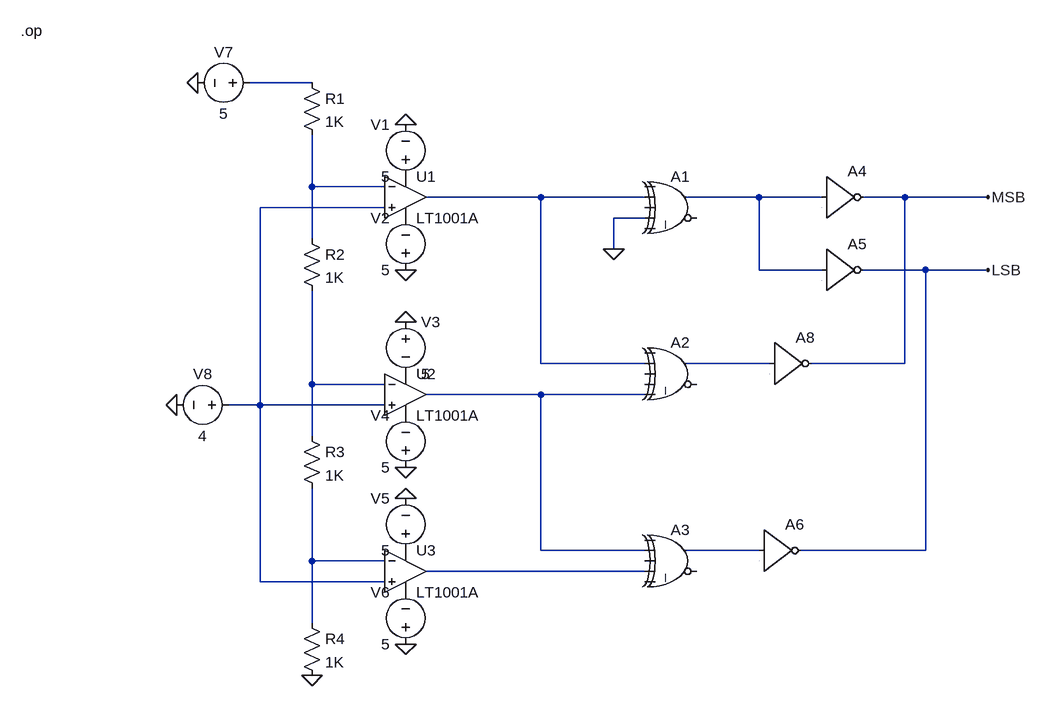
[diagram p0: schematic ADC using Op Amps.asc]
ADC using Op Amps.asc, the LTspice schematic file:
Version 4
SHEET 1 1192 708
WIRE 48 -224 -48 -224
WIRE 48 -64 48 -144
WIRE 160 -64 48 -64
WIRE 400 -48 224 -48
WIRE 560 -48 400 -48
WIRE 736 -48 624 -48
WIRE 832 -48 736 -48
WIRE 960 -48 896 -48
WIRE 1088 -48 960 -48
WIRE 160 -32 -32 -32
WIRE 560 -16 512 -16
WIRE 48 16 48 -64
WIRE 512 32 512 -16
WIRE 736 64 736 -48
WIRE 832 64 736 64
WIRE 992 64 896 64
WIRE 1088 64 992 64
WIRE 400 208 400 -48
WIRE 560 208 400 208
WIRE 752 208 624 208
WIRE 960 208 960 -48
WIRE 960 208 816 208
WIRE 48 240 48 96
WIRE 160 240 48 240
WIRE 400 256 224 256
WIRE 560 256 400 256
WIRE -32 272 -32 -32
WIRE -32 272 -80 272
WIRE 160 272 -32 272
WIRE 48 320 48 240
WIRE 400 496 400 256
WIRE 560 496 400 496
WIRE 736 496 624 496
WIRE 992 496 992 64
WIRE 992 496 800 496
WIRE 48 512 48 400
WIRE 160 512 48 512
WIRE 560 528 224 528
WIRE -32 544 -32 272
WIRE 160 544 -32 544
WIRE 48 608 48 512
FLAG 192 -160 0
FLAG 192 64 0
FLAG -128 -224 0
FLAG 192 144 0
FLAG 192 368 0
FLAG 192 416 0
FLAG 192 640 0
FLAG 48 688 0
FLAG -160 272 0
FLAG 512 32 0
FLAG 1088 -48 MSB
FLAG 1088 64 LSB
SYMBOL OpAmps\\LT1001A 192 -112 R0
SYMATTR InstName U1
SYMBOL OpAmps\\LT1001A 192 192 R0
SYMATTR InstName U2
SYMBOL OpAmps\\LT1001A 192 464 R0
SYMATTR InstName U3
SYMBOL res 32 -240 R0
SYMATTR InstName R1
SYMATTR Value 1K
SYMBOL res 32 0 R0
SYMATTR InstName R2
SYMATTR Value 1K
SYMBOL res 32 304 R0
SYMATTR InstName R3
SYMATTR Value 1K
SYMBOL voltage 192 -64 R180
WINDOW 0 24 96 Left 2
WINDOW 3 24 16 Left 2
WINDOW 123 0 0 Left 0
WINDOW 39 0 0 Left 0
SYMATTR InstName V1
SYMATTR Value 5
SYMBOL voltage 192 80 R180
WINDOW 0 24 96 Left 2
WINDOW 3 24 16 Left 2
WINDOW 123 0 0 Left 0
WINDOW 39 0 0 Left 0
SYMATTR InstName V2
SYMATTR Value 5
SYMBOL voltage 192 384 R180
WINDOW 0 24 96 Left 2
WINDOW 3 24 16 Left 2
WINDOW 123 0 0 Left 0
WINDOW 39 0 0 Left 0
SYMATTR InstName V4
SYMATTR Value 5
SYMBOL voltage 192 512 R180
WINDOW 0 24 96 Left 2
WINDOW 3 24 16 Left 2
WINDOW 123 0 0 Left 0
WINDOW 39 0 0 Left 0
SYMATTR InstName V5
SYMATTR Value 5
SYMBOL voltage 192 656 R180
WINDOW 0 24 96 Left 2
WINDOW 3 24 16 Left 2
WINDOW 123 0 0 Left 0
WINDOW 39 0 0 Left 0
SYMATTR InstName V6
SYMATTR Value 5
SYMBOL voltage -32 -224 R90
WINDOW 0 -32 56 VBottom 2
WINDOW 3 32 56 VTop 2
WINDOW 123 0 0 Left 0
WINDOW 39 0 0 Left 0
SYMATTR InstName V7
SYMATTR Value 5
SYMBOL voltage 192 128 R0
WINDOW 123 0 0 Left 0
WINDOW 39 0 0 Left 0
SYMATTR InstName V3
SYMATTR Value 5
SYMBOL res 32 592 R0
SYMATTR InstName R4
SYMATTR Value 1K
SYMBOL voltage -64 272 R90
WINDOW 0 -32 56 VBottom 2
WINDOW 3 32 56 VTop 2
WINDOW 123 0 0 Left 0
WINDOW 39 0 0 Left 0
SYMATTR InstName V8
SYMATTR Value 4
SYMBOL Digital\\xor 608 -96 R0
SYMATTR InstName A1
SYMBOL Digital\\xor 608 160 R0
SYMATTR InstName A2
SYMBOL Digital\\xor 608 448 R0
SYMATTR InstName A3
SYMBOL Digital\\inv 832 -112 R0
SYMATTR InstName A4
SYMBOL Digital\\inv 832 0 R0
SYMATTR InstName A5
SYMBOL Digital\\inv 736 432 R0
SYMATTR InstName A6
SYMBOL Digital\\inv 752 144 R0
SYMATTR InstName A8
TEXT -400 -304 Left 2 !.op

The netlist it stands for:
* ADC using Op Amps.asc
XU1 N005 N002 P001 P002 N003 LT1001  ; LT1001A, pins In+ In- V+ V- OUT
XU2 N005 N007 P003 P004 N008 LT1001  ; LT1001A, pins In+ In- V+ V- OUT
XU3 N005 N010 P005 P006 N011 LT1001  ; LT1001A, pins In+ In- V+ V- OUT
R1 N001 N002 1K
R2 N002 N007 1K
R3 N007 N010 1K
V1 P001 0 5
V2 0 P002 5
V4 0 P004 5
V5 P005 0 5
V6 0 P006 5
V7 N001 0 5
V3 0 P003 5
R4 N010 0 1K
V8 N005 0 4
A1 0 N003 0 0 0 0 N004 0 XOR
A2 0 N003 0 0 N008 0 N006 0 XOR
A3 0 N008 0 N011 0 0 N009 0 XOR
A4 N004 0 0 0 0 MSB 0 0 BUF
A5 N004 0 0 0 0 LSB 0 0 BUF
A6 N009 0 0 0 0 LSB 0 0 BUF
A8 N006 0 0 0 0 MSB 0 0 BUF
.op
.lib LTC.lib
.backanno
.end